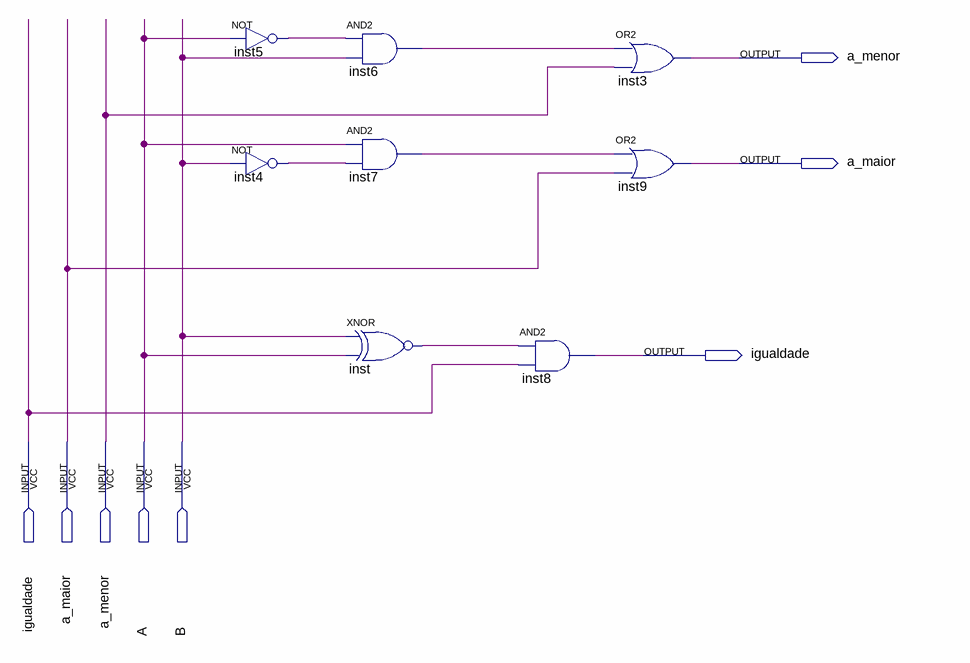
[diagram p0: schematic sheet]
// Quartus schematic full_magnitude.bdf as structural Verilog: 8 symbols, 8 pins
module full_magnitude (
  inout  igualdade,
  inout  a_maior,
  inout  a_menor,
  input  A,
  input  B
);

  wire inst4_out, inst5_out, inst6_out, inst7_out, inst_out;

  not inst5 (inst5_out, A);
  not inst4 (inst4_out, B);
  and inst6 (inst6_out, inst5_out, B);
  and inst7 (inst7_out, A, inst4_out);
  xnor inst (inst_out, B, A);
  and inst8 (igualdade, inst_out, igualdade);
  or inst3 (a_menor, inst6_out, a_menor);
  or inst9 (a_maior, inst7_out, a_maior);
endmodule
